# EAGLE design Aroca_EPS-v.2.0 (EAGLE 9.4.2)
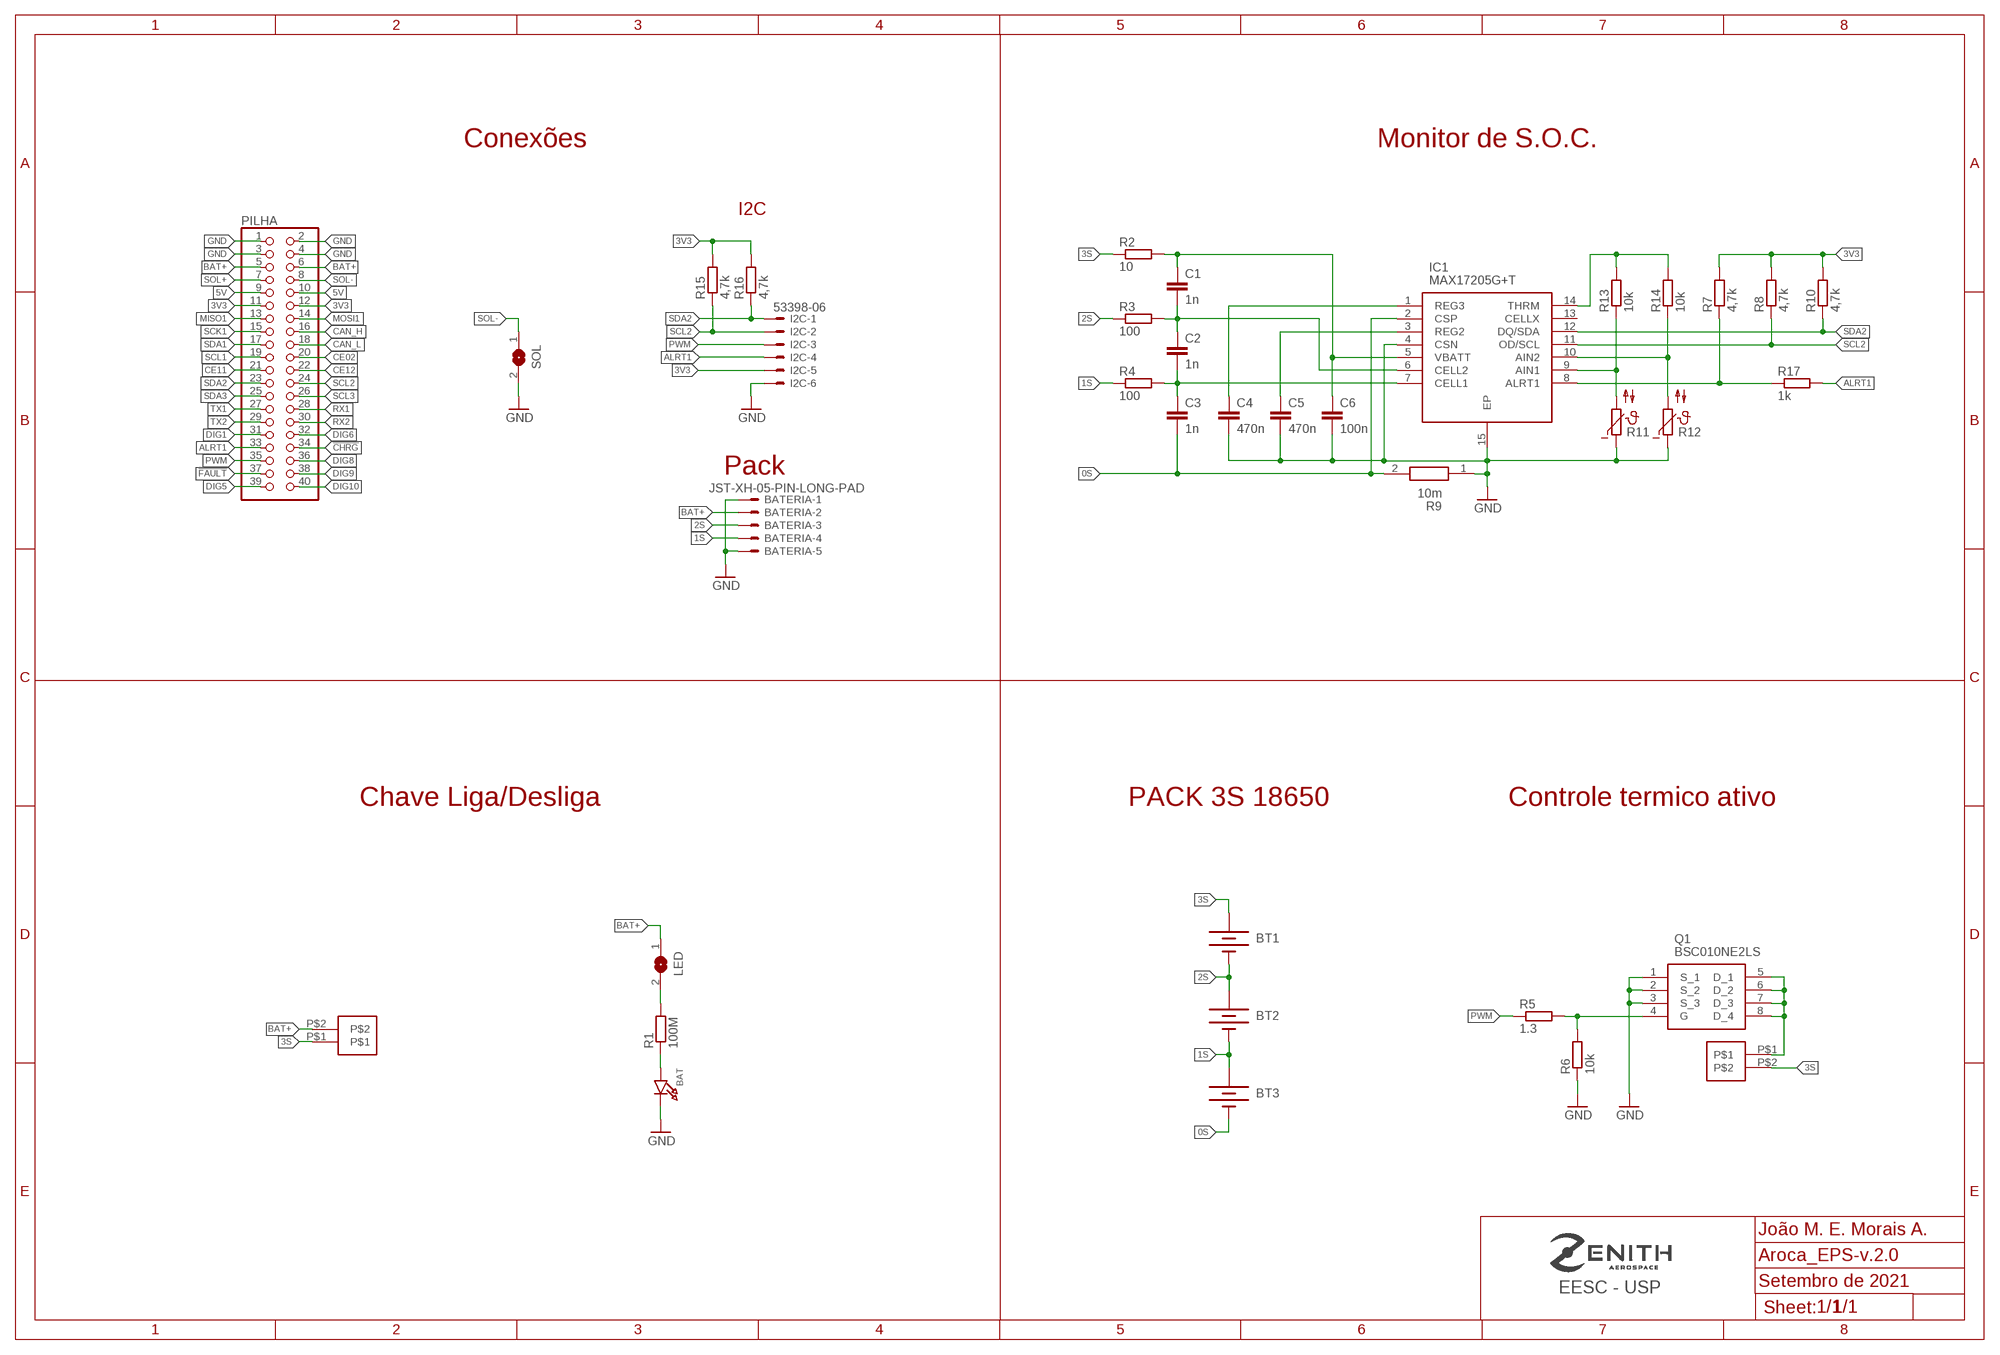
[diagram p0: schematic, sheet 1]

## Parts
BAT  LED1206  [CHIPLED_1206]
BATERIA  JST-XH-05-PIN-LONG-PAD  [JST-XH-05-PACKAGE-LONG-PAD]
BT1  BATTERY-18650  [BATTERY_18650-HOLDER]
BT2  BATTERY-18650  [BATTERY_18650-HOLDER]
BT3  BATTERY-18650  [BATTERY_18650-HOLDER]
C1  1n  C-EUC0805  [C0805]
C2  1n  C-EUC0805  [C0805]
C3  1n  C-EUC0805  [C0805]
C4  470n  C-EUC0805  [C0805]
C5  470n  C-EUC0805  [C0805]
C6  100n  C-EUC0805  [C0805]
I2C  53398-06  [53398-06]
IC1  MAX17205G+T  [SON40P300X300X80-15N]
LED  SOLDERJUMPERREFLOW_NOPASTE  [SOLDERJUMPER_REFLOW_NOPASTE]
PILHA  PINHD-2X20  [2X20]
Q1  BSC010NE2LS  [PG-TDSON-8]
R1  100M  R-EU_R0805  [R0805]
R2  10  R-EU_0204/7  [0204/7]
R3  100  R-EU_0204/7  [0204/7]
R4  100  R-EU_0204/7  [0204/7]
R5  1.3  R-EU_R0805  [R0805]
R6  10k  R-EU_R0805  [R0805]
R7  4,7k  R-EU_R0805  [R0805]
R8  4,7k  R-EU_R0805  [R0805]
R9  10m  GMR320HJBFA10L0  [GMR320HJBFA10L0]
R10  4,7k  R-EU_R0805  [R0805]
R11  NTC640  [P640]
R12  NTC640  [P640]
R13  10k  R-EU_R0805  [R0805]
R14  10k  R-EU_R0805  [R0805]
R15  4,7k  R-EU_R0805  [R0805]
R16  4,7k  R-EU_R0805  [R0805]
R17  1k  R-EU_R0805  [R0805]
SOL  SOLDERJUMPERREFLOW_NOPASTE  [SOLDERJUMPER_REFLOW_NOPASTE]
U$1  S02B-XASS-1  [S02B-XASS-1]
U$2  B02B-XASK-1  [B02B-XASK-1]

## Nets
0S: BT3.GND@1(-) C3.2 IC1.2(CSP) R9.2
1S: BATERIA.4 BT2.GND@1(-) BT3.PWR@1(+) R4.1
2S: BATERIA.3 BT1.GND@1(-) BT2.PWR@1(+) R3.1
3S: BT1.PWR@1(+) R2.1 U$1.P$1 U$2.P$2
3V3: I2C.5 PILHA.11 PILHA.12 R7.2 R8.2 R10.2 R15.2 R16.2
5V: PILHA.9 PILHA.10
!CHRG: PILHA.34
!FAULT: PILHA.37
ALRT: IC1.8(ALRT1) R7.1 R17.1
ALRT1: I2C.4 PILHA.33 R17.2
BAT+: BATERIA.2 LED.1 PILHA.5 PILHA.6 U$1.P$2
CAN_H: PILHA.16
CAN_L: PILHA.18
CE02: PILHA.20
CE11: PILHA.21
CE12: PILHA.22
DIG1: PILHA.31
DIG5: PILHA.39
DIG6: PILHA.32
DIG8: PILHA.36
DIG9: PILHA.38
DIG10: PILHA.40
GND: BAT.C BATERIA.1 BATERIA.5 C4.2 C5.2 C6.2 I2C.6 IC1.4(CSN) IC1.15(EP) PILHA.1 PILHA.2 PILHA.3 PILHA.4 Q1.1(S_1) Q1.2(S_2) Q1.3(S_3) R6.1 R9.1 R11.1 R12.1 SOL.2
MISO1: PILHA.13
MOSI1: PILHA.14
N$1: BAT.A R1.1
N$2: LED.2 R1.2
N$5: Q1.4(G) R5.2 R6.2
N$14: C4.1 IC1.1(REG3)
N$15: C5.1 IC1.3(REG2)
N$16: C1.1 C6.1 IC1.5(VBATT) R2.2
N$17: C2.2 C3.1 IC1.7(CELL1) R4.2
N$18: C1.2 C2.1 IC1.6(CELL2) R3.2
N$20: IC1.14(THRM) R13.2 R14.2
N$21: IC1.9(AIN1) R11.2 R13.1
N$22: IC1.10(AIN2) R12.2 R14.1
PWM: I2C.3 PILHA.35 R5.1
RL: Q1.5(D_1) Q1.6(D_2) Q1.7(D_3) Q1.8(D_4) U$2.P$1
RX1: PILHA.28
RX2: PILHA.30
SCK1: PILHA.15
SCL1: PILHA.19
SCL2: I2C.2 IC1.11(OD/SCL) PILHA.24 R8.1 R15.1
SCL3: PILHA.26
SDA1: PILHA.17
SDA2: I2C.1 IC1.12(DQ/SDA) PILHA.23 R10.1 R16.1
SDA3: PILHA.25
SOL+: PILHA.7
SOL-: PILHA.8 SOL.1
TX1: PILHA.27
TX2: PILHA.29
Unconnected: IC1.13(CELLX)

## Notes on the sheet
- Conexões | Monitor de S.O.C.
- I2C
- Pack
- Chave Liga/Desliga | PACK 3S 18650 | Controle termico ativo
- João M. E. Morais A.
- EESC - USP | Setembro de 2021
- 1/1
- C:/Users/marcu/Desktop/Ensino Superior/Graduação - Eng Elétrica/Zenith/zenith-v2.bmp

## Library data of the parts
BAT = microbuilder:LED: LED 0603 - 0603 Surface Mount Package 2mA: Green LED - Low Power (3.9mcd, 2ma, 1.7Vf) - Digikey: 475-2709-2-ND Orange LED - Low Power (9.8mcd, 2ma, 1.8Vf) - Digikey: 475-1194-2-ND Red LED - Low Power (5mcd, 2ma, 1.8Vf) - Digikey: 475-1195-2-ND Yellow LED - Low Power (7mcd, 2ma, 1.8Vf) - Digikey: 475-1196-2-ND 5mA: Blue LED - Low Power (17mcd, 5ma, 2.9Vf) - Digikey: LNJ937W8CRACT-ND 0805 - 0805 Surface Mount Package 2mA: Red LED (8.8mcd, 2mA, 1.8Vf, Clear) - Low Power [Digikey: 475-2510-1-ND] Green LED (5mcd, 2mA, 1.8Vf, Clear) - Low Power [Digikey: 475-2730-1-ND] Yellow LED (11.3mcd, 2mA, 1.8Vf, Clear) - Low Power [Digikey: 475-2555-1-ND] 20mA: Red LED (104mcd, 20mA, Diffused) - LS R976 [Digikey: 475-1278-6-ND] Red LED (12mcd, 20mA, 2.0Vf, Clear) - APT2012EC [Digikey: 754-1128-1-ND] Green LED (15mcd, 20mA, 2.2Vf, Clear) - APT2012GC [Digikey: 754-1131-1-ND] Orange LED (160mcd, 20mA, 2.1Vf, Clear) - APT2012SECK [Digikey: 754-1130-1-ND] 1206 - 1206 Surface Mount Package Green LED (26mcd, 20mA, Diffused) - LG N971 [Digikey: 475-1407-6-ND] Red LED (15mcd, 20mA, Diffused) - LH N974 [Digikey: 475-1416-6-ND]
BATERIA = JST-XH-Zenith:JST-XH-05-PIN: JST XH Connector 2 Pin Wire to board connector. Pitch: 2,54 mm, (0.100") Number of pins: 5 Created by Rembrandt Electronics www.rembrandtelectronics.com
BT1-BT3 = SparkFun-Batteries:BATTERY: Battery - Single Cell A variety of battery chemistries, sizes, and footprints. Device List: 20MM_PTH - Coin Cell Battery Holder - 20mm (PTH) <https://www.sparkfun.com/products/783> 6.8MM_PTH - Coin Cell Battery Holder - 6.8MM(SMD) <https://www.digikey.com/product-detail/en/seiko-instruments/MS621FE-FL11E/728-1057-ND/1889208?WT.srch=1&gclid=CNOQ5a6LzdQCFZS2wAodXCkE0g> 12MM_SMD - Coin Cell Battery Holder - 12mm (SMD) <https://www.sparkfun.com/products/10592> 12MM_PTH - Coin Cell Battery Holder - 12mm (PTH) <https://www.sparkfun.com/products/7948> 20MM_SMD - 20mm Coin Cell Battery Holder (SMD) (2 legs) Used on the Big Time Watch Kit <https://www.sparkfun.com/products/11734> 20MM_SMD_4LEGS - Coin Cell Battery Holder - 20mm (SMD) <https://www.sparkfun.com/products/11892> 20MM_SMD_4LEGS_OVERPASTE - Coin Cell Battery Holder - 20mm (SMD) <https://www.sparkfun.com/products/11892> (Over-paste on the legs) 24.5MM_PTH - Coin Cell Battery Holder - 24.5mm (PTH) <https://www.sparkfun.com/products/8863> 9V - 9V Battery Holder - PC Mount Used on the SparkFun SparkPunk Sound Kit <https://www.sparkfun.com/products/11177> and SparkFun SparkPunk Sequencer Kit <https://www.sparkfun.com/products/12707> 18650 - Battery Holder - 18650 (PTH) <https://www.sparkfun.com/products/13113> AA - Battery Holder - 1xAA (PTH) <https://www.sparkfun.com/products/7949> AAA - Battery Holder - 1xAAA (PTH) <https://www.sparkfun.com/products/12718> AA_KIT - Battery Holder - 1xAA (PTH) <https://www.sparkfun.com/products/7949> Special kit package - pads only have exposed copper on one side of the board. AAA_KIT - Battery Holder - 1xAAA (PTH) <https://www.sparkfun.com/products/12718> Special kit package - pads only have exposed copper on one side of the board.; PROD_ID: BATT-12327; SF_SKU: PRT-13113
C1-C6 = rcl:C-EU: CAPACITOR, European symbol; SPICEPREFIX: C
I2C = con-zenith:53?-06: CONNECTOR wire to board 1.25 mm (.049 inch) pitch header; MF: MOLEX; OC_FARNELL: 1125368; OC_NEWARK: unknown
IC1 = SamacSys_Parts:MAX17205G+T: Battery Management MODELGAUGE M5 (MULTI-CELL) TDFN Source: Datasheet <https://componentsearchengine.com/Datasheets/1/MAX17205G T.pdf>; DESCRIPTION: Battery Management MODELGAUGE M5 (MULTI-CELL) TDFN; HEIGHT: 0.8mm; MANUFACTURER_NAME: Maxim Integrated; MANUFACTURER_PART_NUMBER: MAX17205G+T; MOUSER_PART_NUMBER: 700-MAX17205G+T; MOUSER_PRICE-STOCK: https://www.mouser.co.uk/ProductDetail/Maxim-Integrated/MAX17205G%2bT?qs=sO%2FZ8XQFeM14gpZbIvukxg%3D%3D
LED SOL = microbuilder:SOLDERJUMPER: SMD Solder JUMPER Solder the two pads together to create a connection, or remove the solder to break it. REFLOW - Use this footprint for solder paste and reflow ovens. WAVE - Use this footprint for hand-soldering (larger pads). CLOSED - Has a trace between the two pads to ensure it is closed by default. The trace needs to be cut to disable the jumper, and can be closed again by creating a solder bridge between the two pads.
PILHA = pinhead:PINHD-2X20: PIN HEADER
Q1 = SamacSys_Parts:BSC010NE2LS: Infineon BSC010NE2LS N-channel MOSFET Transistor, 100 A, 25 V, 8-Pin TDSON Source: Datasheet <https://www.infineon.com/dgdl/Infineon-BSC010NE2LS-DS-v02_02-en.pdf?fileId=db3a304326dfb1300126fb3d176a3f1b>; DESCRIPTION: Infineon BSC010NE2LS N-channel MOSFET Transistor, 100 A, 25 V, 8-Pin TDSON; HEIGHT: mm; MANUFACTURER_NAME: Infineon; MANUFACTURER_PART_NUMBER: BSC010NE2LS; MOUSER_PART_NUMBER: 726-BSC010NE2LS; MOUSER_PRICE-STOCK: https://www.mouser.co.uk/ProductDetail/Infineon-Technologies/BSC010NE2LS?qs=HwMeRNENlMYcZAtWDSufww%3D%3D
R1-R8 R10 R13-R17 = rcl:R-EU_: RESISTOR, European symbol; SPICEPREFIX: R
R9 = SamacSys_Parts:GMR320HJBFA10L0: 10 +/-1% 10W Chip Resistor 2817 (7142 Metric) Current Sense Metal Element Source: Datasheet <https://fscdn.rohm.com/en/products/databook/datasheet/passive/resistor/chip_resistor/gmr-e.pdf>; DESCRIPTION: 10 +/-1% 10W Chip Resistor 2817 (7142 Metric) Current Sense Metal Element; HEIGHT: 0.55mm; MANUFACTURER_NAME: ROHM Semiconductor; MANUFACTURER_PART_NUMBER: GMR320HJBFA10L0; MOUSER_PART_NUMBER: 755-GMR320HJBFA10L0; MOUSER_PRICE-STOCK: https://www.mouser.co.uk/ProductDetail/ROHM-Semiconductor/GMR320HJBFA10L0?qs=iLbezkQI%252BsjglnCQsDzdJA%3D%3D
R11 R12 = ptc-ntc:NTC640: PHILIPS NTC; OC_FARNELL: unknown; OC_NEWARK: unknown
U$1 = JST-XA:S02B-XASS-1
U$2 = JST-XA:B02B-XASK-1

## Board
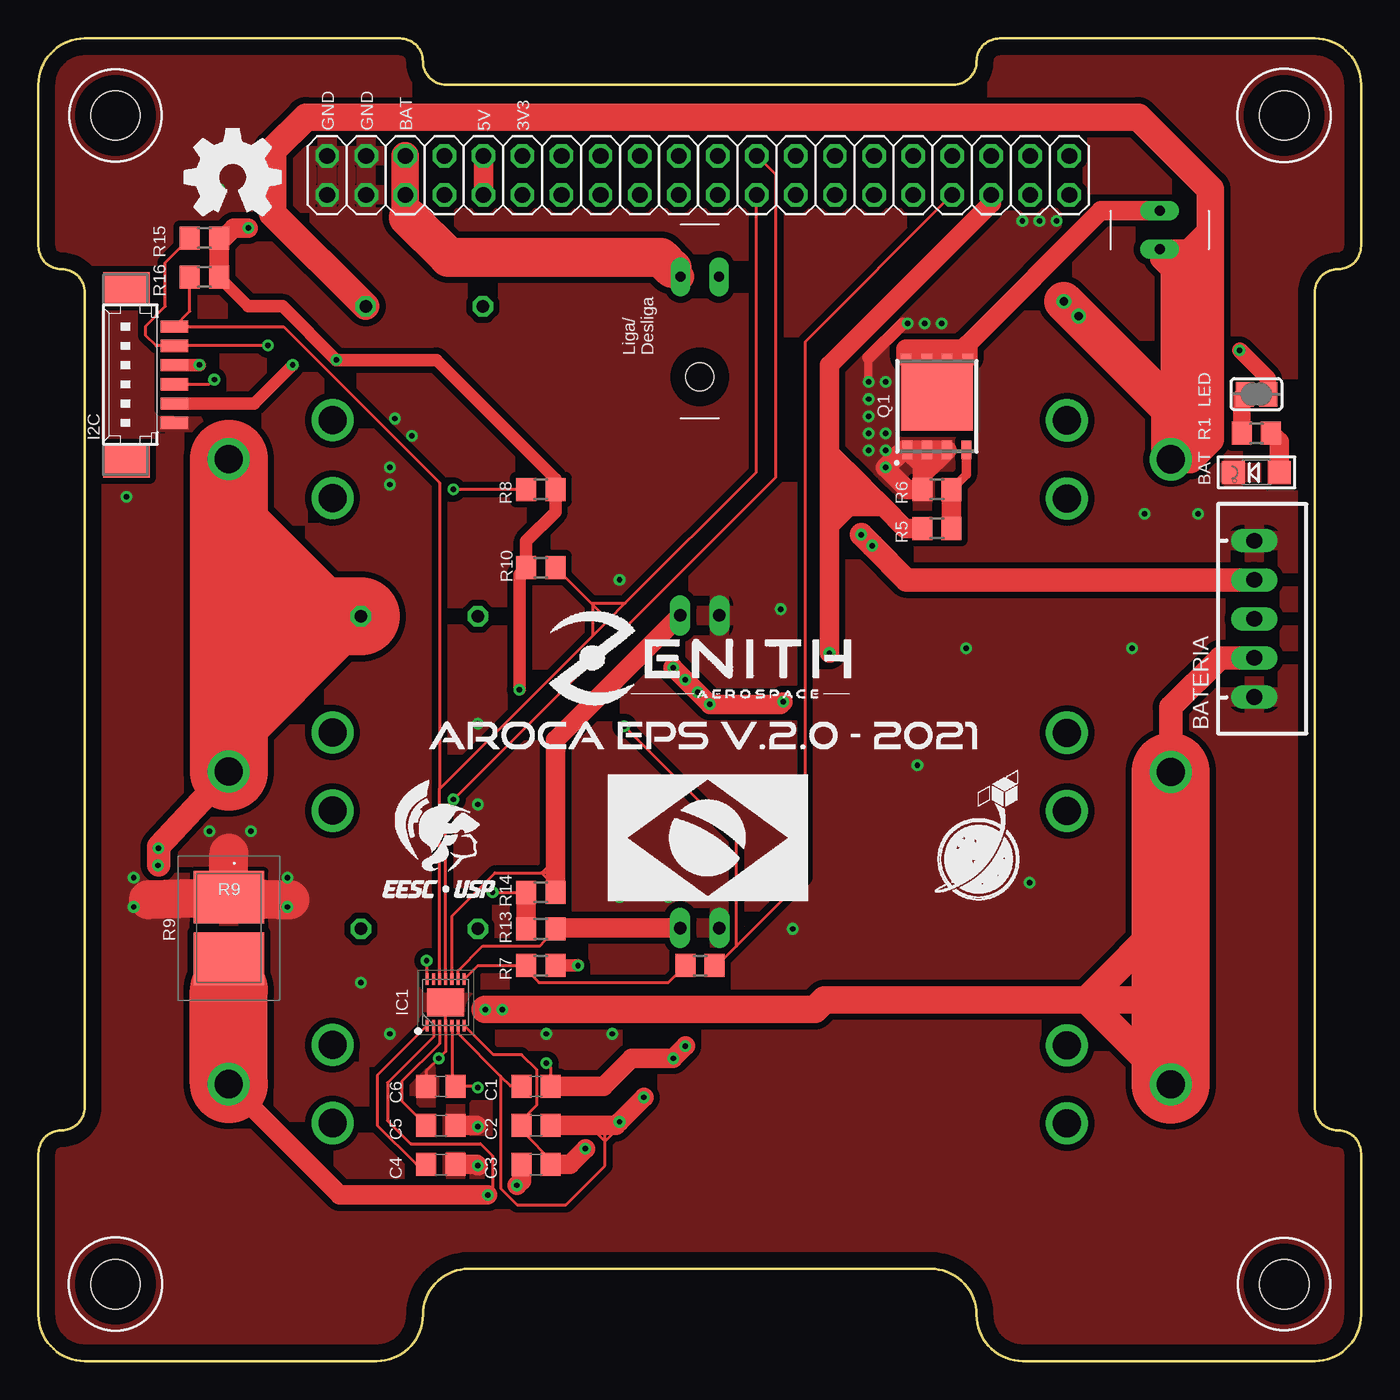
[diagram p1: board, top side]
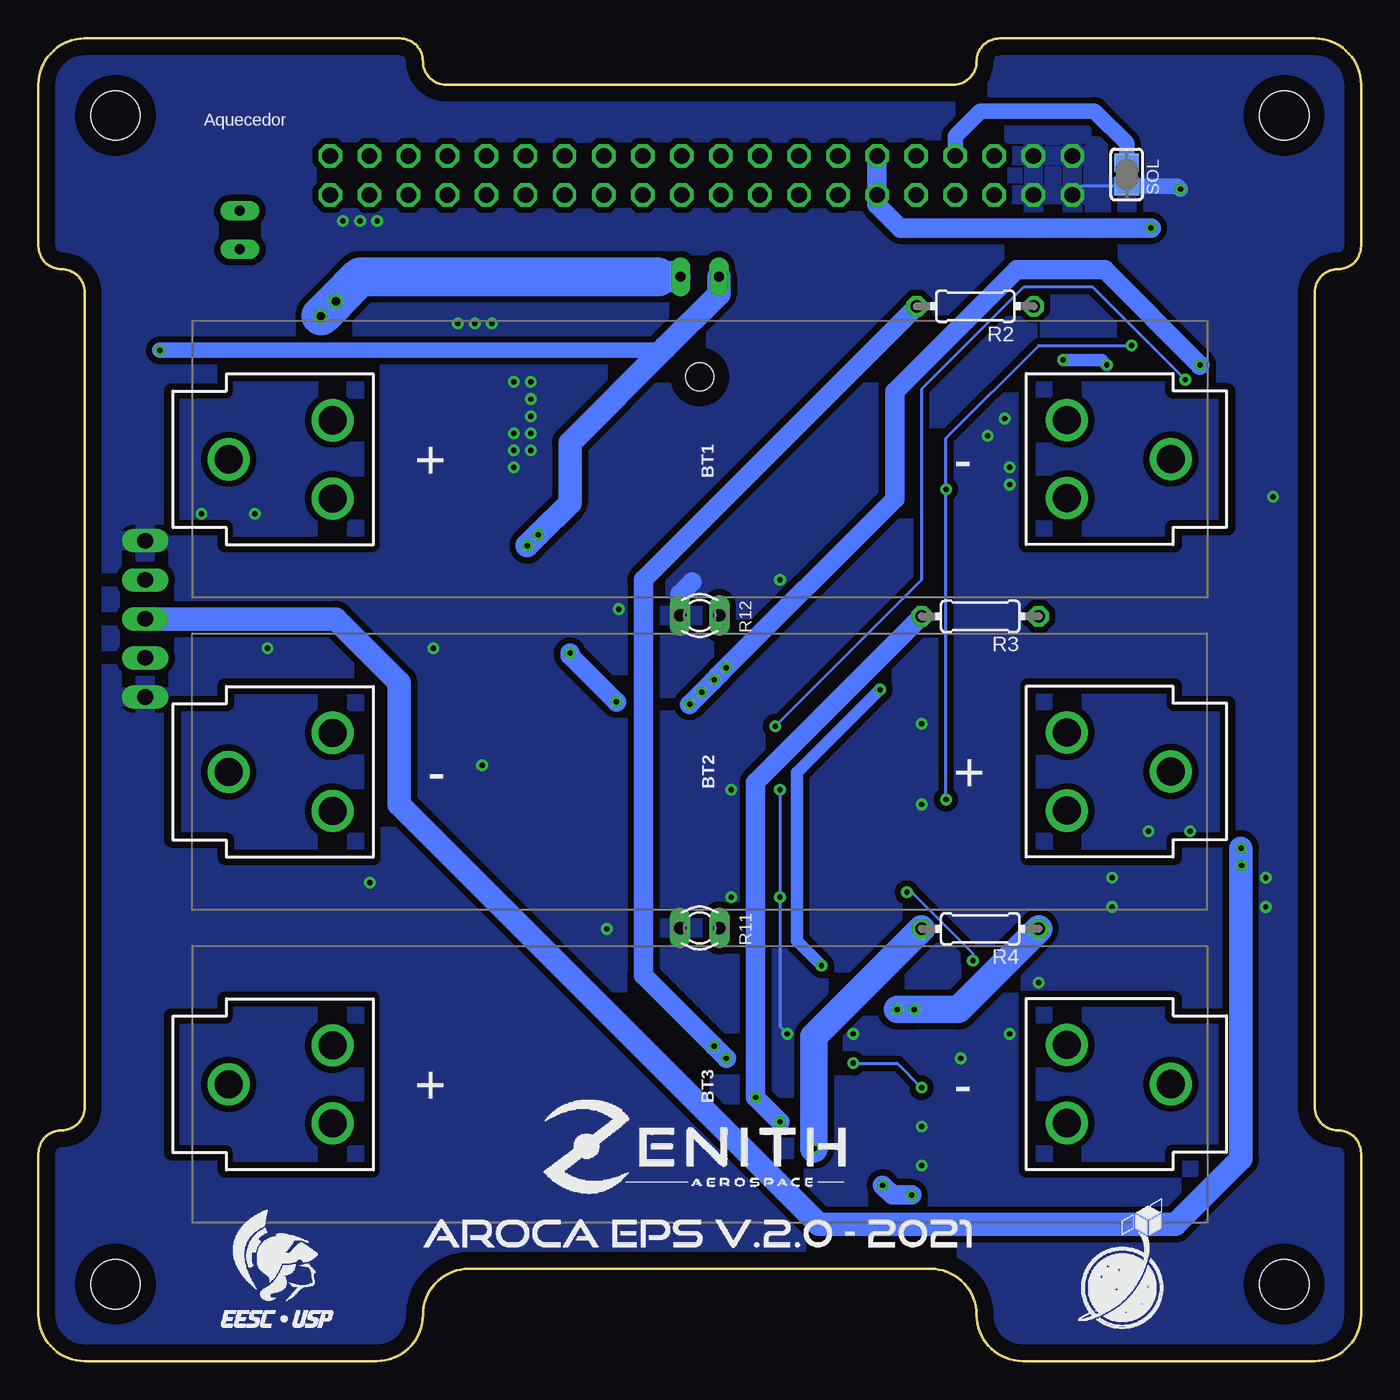
[diagram p2: board, bottom side, seen from below]

Size 86 x 86 mm. Coordinates in mm from the lower left corner, seen from the top.
Outline: 0,83 0,72.5 arc90 1.5,71 arc-90 3,69.5 3,16.5 arc-90 1.5,15 arc90 0,13.5 0,3 arc90 3,0 22,0 arc90 25,3 arc-90 28,6 58,6 arc-90 61,3 arc90 64,0 83,0 arc90 86,3 86,13.5 arc90 84.5,15 arc-90 83,16.5 83,69.5 arc-90 84.5,71 arc90 86,72.5 86,83 arc90 83,86 62.5,86 arc90 61,84.5 arc-90 59.5,83 26.5,83 arc-90 25,84.5 arc90 23.5,86 3,86 arc90 0,83
Copper layers (1*16): Top 0.035mm / dielectric 1.5mm / Bottom 0.035mm
Design rules "default *": minimum track width 6mil, minimum drill 0.35mm, track to track 6mil, track to pad 6mil, pad to pad 6mil, via to via 6mil, smd to smd 6mil, copper to edge 40mil, drill to drill 6mil, minimum pad ring 10mil, minimum via ring 8mil, stop-mask expansion 4mil, vias tented up to drill 30mil, thermal gap 10mil
Holes 3.2 mm at 5,5 81,5 81,81 5,81

### Footprints (pad centres in the part's own frame; a part is rotated, then mirrored left to right if it is on the bottom)
CHIPLED_1206 = smd 1.5 x 1.5: A 0,-1.496; C 0,1.496
JST-XH-05-PACKAGE-LONG-PAD = drill 1.016 long: 1 -5.08,0; 2 -2.54,0; 3 0,0; 4 2.54,0; 5 5.08,0
BATTERY_18650-HOLDER = drill 1.829: GND@1 30.628,0.01; GND@2 23.88,2.55; GND@3 23.88,-2.53; PWR@1 -30.628,-0.01; PWR@2 -23.88,2.53; PWR@3 -23.88,-2.55
C0805 = smd 1.3 x 1.5: 1 -0.95,0; 2 0.95,0
53398-06 = smd 0.8 x 1.8: 1 3.125,-2.5; 2 1.875,-2.5; 3 0.625,-2.5; 4 -0.625,-2.5; 5 -1.875,-2.5; 6 -3.125,-2.5 | smd 2.1 x 3: S1 5.625,0.625; S2 -5.625,0.625
SON40P300X300X80-15N = smd 0.75 x 0.2: 1 -1.5,1.2; 2 -1.5,0.8; 3 -1.5,0.4; 4 -1.5,0; 5 -1.5,-0.4; 6 -1.5,-0.8; 7 -1.5,-1.2; 8 1.5,-1.2; 9 1.5,-0.8; 10 1.5,-0.4; 11 1.5,0; 12 1.5,0.4; 13 1.5,0.8; 14 1.5,1.2 | smd 1.8 x 2.4: 15 0,0
SOLDERJUMPER_REFLOW_NOPASTE = smd 1.168 x 1.6: 1 -0.762,0; 2 0.762,0
2X20 = drill 1.016 octagon: 1 -24.13,-1.27; 2 -24.13,1.27; 3 -21.59,-1.27; 4 -21.59,1.27; 5 -19.05,-1.27; 6 -19.05,1.27; 7 -16.51,-1.27; 8 -16.51,1.27; 9 -13.97,-1.27; 10 -13.97,1.27; 11 -11.43,-1.27; 12 -11.43,1.27; 13 -8.89,-1.27; 14 -8.89,1.27; 15 -6.35,-1.27; 16 -6.35,1.27; 17 -3.81,-1.27; 18 -3.81,1.27; 19 -1.27,-1.27; 20 -1.27,1.27; 21 1.27,-1.27; 22 1.27,1.27; 23 3.81,-1.27; 24 3.81,1.27; 25 6.35,-1.27; 26 6.35,1.27; 27 8.89,-1.27; 28 8.89,1.27; 29 11.43,-1.27; 30 11.43,1.27; 31 13.97,-1.27; 32 13.97,1.27; 33 16.51,-1.27; 34 16.51,1.27; 35 19.05,-1.27; 36 19.05,1.27; 37 21.59,-1.27; 38 21.59,1.27; 39 24.13,-1.27; 40 24.13,1.27
PG-TDSON-8 = smd 0.65 x 1.2: 1 -1.905,-6; 2 -0.635,-6; 3 0.635,-6; 4 1.905,-6 | smd 0.7 x 0.5: 5 2,0; 6 0.665,0; 7 -0.665,0; 8 -2,0 | smd 4.7 x 4.5: 9 0,-2.5
R0805 = smd 1.3 x 1.5: 1 -0.95,0; 2 0.95,0
0204/7 = drill 0.813 octagon: 1 -3.81,0; 2 3.81,0
GMR320HJBFA10L0 = smd 3.4 x 4.6: 1 -2,0; 2 2,0
P640 = drill 0.813 long: 1 -1.27,0; 2 1.27,0
S02B-XASS-1 = drill 0.65 pad 1.27 long: P$1 0,0; P$2 2.5,0 | hole 1.8: 1.25,6.5
B02B-XASK-1 = drill 0.65 pad 1.27 long: P$1 0,0; P$2 2.5,0

### Placement (x,y rotation side)
BAT  79.19,57.78 90 top
BATERIA  79.06,48.26 270 top
BT1  43,58.64 0 bottom
BT2  43,38.32 180 bottom
BT3  43,18 0 bottom
C1  32.35,17.86 180 top
C2  32.35,15.32 180 top
C3  32.35,12.78 180 top
C4  26.16,12.78 0 top
C5  26.16,15.32 0 top
C6  26.16,17.86 180 top
I2C  6.35,64.14 90 top
IC1  26.48,23.32 90 top
LED  79.19,62.87 180 top
PILHA  42.9,77.1 0 top
Q1  58.42,65.25 0 top
R1  79.19,60.33 180 top
R2  25.09,68.58 180 bottom
R3  24.77,48.42 180 bottom
R4  24.77,28.1 180 bottom
R5  58.42,54.13 0 top
R6  58.42,56.67 0 top
R7  32.67,25.72 0 top
R8  32.67,56.67 0 top
R9  12.38,28.16 270 top
R10  32.67,51.59 180 top
R11  43,28.16 0 bottom
R12  43,48.48 0 bottom
R13  32.67,28.1 180 top
R14  32.67,30.48 180 top
R15  10.79,73.03 0 top
R16  10.79,70.48 0 top
R17  43.02,25.72 0 top
SOL  15.24,77.15 270 bottom
U$1  44.25,70.5 180 top
U$2  72.9,74.8 270 top

### Tracks (layer width: path | path; a pad name or v marks a point on that pad's centre or on a via)
0S  (via drill 0.35)
  Top 0.2: IC1.2 25.68,21.08 22.7,18.1 22.7,15.63 24.2,14.13 28.73,14.13 29.53,13.34 29.53,11.11 v29.21,10.79
  Top 1.27: C3.2 31.4,11.72 v31.11,11.43 | BT3.GND@1 19.59,10.79 v29.21,10.79
  Top 3.302: 12.38,24.13 R9.2
  Top 5.08: BT3.GND@1 12.37,24.12 12.38,24.13
  Bottom 1.27: v31.11,11.43 30.48,10.79 v29.21,10.79
1S  (via drill 0.35)
  Top 1.27: 73.63,29 73.63,29.21
  Top 1.524: BATERIA.4 76.83,45.72 73.63,42.51 BT2.GND@1
  Top 1.778: v29.05,22.86 v30.16,22.86 50.48,22.86 51.12,23.5 68.12,23.5 | 68.12,23.5 BT3.PWR@1 | 68.12,23.5 73.63,29 | 68.12,23.5 73.63,23.5
  Top 5.08: BT3.PWR@1 73.63,23.5 73.63,29.21 BT2.GND@1
  Bottom 1.778: R4.1 26.2,22.86 v29.05,22.86 v30.16,22.86
2S  (via drill 0.35)
  Top 1.27: v7.78,32.23 7.81,32.26
  Top 1.524: BT2.PWR@1 7.81,33.45 v7.81,33.34 7.81,32.26
  Top 5.08: BT1.GND@1 12.37,54.29 | 12.37,54.29 12.37,46.99 | 12.37,46.99 12.37,41.59 | 12.37,41.59 BT2.PWR@1 | 12.37,54.29 18.72,47.94 12.37,41.59 | R3.1 13.8,48.42 12.37,46.99
  Bottom 1.524: BATERIA.3 66.67,48.26 62.55,44.13 62.55,36.2 35.24,8.89 12.06,8.89 7.81,13.14 v7.81,33.34
3S  (via drill 0.55)
  Top 1.27: 74.71,72.3 U$2.P$2 72.9,71.66 74.26,70.3 | 74.71,72.3 75.56,71.44 | 74.71,72.3 76.2,73.79 76.2,74.37
  Top 1.778: BT1.PWR@1 74.9,58.63 76.2,59.93 76.2,74.37 76.2,76.2 71.51,80.89 17.39,80.89 15.24,78.74 15.24,74.62 R2.1
  Top 2.54: v66.67,68.9 v67.63,67.94 73.63,61.94 BT1.PWR@1 74.26,59.27 74.26,70.3 74.26,71.09 74.3,71.12
  Bottom 1.27: U$1.P$1 44.6,70.5 44.61,70.48
  Bottom 2.032: 45.72,70.5 44.6,70.5
  Bottom 2.54: 45.72,70.5 65.08,70.5 v66.67,68.9 v67.63,67.94
3V3  (via drill 0.35)
  Top 0.813: I2C.5 14.02,62.26 v16.52,64.77 | R16.2 13.65,68.58 15.88,68.58 v19.37,65.09 25.87,65.09 33.62,57.34 R8.2 33.62,55.21 31.72,53.31 R10.2 31.27,51.15 v31.27,43.66 | R7.2 v35.08,25.72
  Top 1.27: R15.2 11.74,72.72 | 11.74,72.72 R16.2 | v13.65,73.67 12.7,73.67 11.74,72.72
  Bottom 0.813: v19.37,65.09 16.84,65.09 v16.52,64.77 | v35.08,25.72 36.67,27.3 36.67,38.26 v31.27,43.66
  Bottom 1.27: PILHA.12 PILHA.11 31.47,75.2 29.94,73.67 v13.65,73.67
5V
  Top 1.27: PILHA.10 PILHA.9
ALRT
  Top 0.2: IC1.8 28.58,25.72 R7.1 31.72,25.43 32.54,24.61 40.96,24.61 R17.1
ALRT1  (via drill 0.35)
  Top 0.2: 45.4,26.99 49.85,31.43 49.85,66.27 PILHA.33 | v38.1,41.27 45.4,33.97 45.4,26.99 | I2C.4 11.09,63.51 11.4,63.82 v11.43,63.82 | 45.4,26.99 44.13,25.72 R17.2
  Bottom 0.2: v38.1,41.27 28.57,50.8 28.57,63.19 21.91,69.86 17.46,69.86 v11.43,63.82
BAT+  (via drill 0.35)
  Top 1.016: LED.1 79.96,63.87 v78.11,65.72
  Top 1.524: v53.5,53.74 v54.21,53.02 56.44,50.8 BATERIA.2
  Top 1.778: PILHA.6 PILHA.5 23.85,74.58 24.05,74.37 | 41.2,71.05 U$1.P$2
  Top 2.54: 41.2,71.05 40.48,71.77 26.66,71.77 24.05,74.37
  Bottom 1.016: v78.11,65.72 45.4,65.72 45.24,65.88
  Bottom 1.524: U$1.P$2 41.75,69.38 45.24,65.88 51.44,59.69 51.44,55.8 v53.5,53.74 v54.21,53.02
GND  (via drill 0.35)
  Top 0.2: IC1.15 IC1.4 26.48,20.13 v26.04,19.68 25.21,18.86 C6.2 | 28.5,15.32 v28.57,15.24
  Top 0.508: v53.98,63.66 53.98,65.25 | 56.2,67.47 v56.52,67.47
  Top 0.813: 56.2,67.47 53.98,65.25
  Top 1.27: C5.2 28.5,15.32 | C4.2 28.5,12.78 v28.57,12.7 | 57.47,57.66 R6.1 56.52,56.67 v55.09,58.1 56.23,59.25 Q1.1 | 57.47,57.66 Q1.3 Q1.1 | Q1.1 57.47,58.29 57.47,57.66
  Top 2.54: R9.1 16.35,30 | R9.1 12.38,33.02 | R9.1 7.15,30
  Bottom 0.2: SOL.2 18.21,76.39 PILHA.1 | v37.78,37.15 v37.78,30.16 37.78,21.75 v37.31,21.27
  Bottom 1.016: SOL.2 11.94,76.39 v11.75,76.2
  Bottom 1.27: R12.1 44.27,49.87 43.5,50.64
  other vias: 37.78,50.8 57.15,38.73 60.33,46.35 5.71,56.2 64.45,31.11 49.05,28.1 55.09,59.21 48.26,48.9 71.12,46.35 71.91,55.09 75.41,55.09 33.02,21.27 22.86,21.27 20.95,24.61 28.57,41.44 28.57,36.2 40.96,37.15 16.19,29.53 16.19,31.43 11.11,34.45 13.81,34.45 6.19,31.43 6.19,29.53 22.86,58.1 22.86,56.99 23.18,61.28 24.29,60.17 40.96,30.16 55.09,60.33 53.98,59.21 53.98,60.33 53.98,61.44 53.98,62.55 55.09,63.66 57.63,67.47 58.74,67.47 66.2,74.14 65.09,74.14 63.98,74.14
  pour Top (isolate 0.406): 64,0 83,0 arc90 86,3 86,13.5 arc90 84.5,15 arc-90 83,16.5 83,69.5 arc-90 84.5,71 arc90 86,72.5 86,83 arc90 83,86 62.5,86 arc90 61,84.5 arc-90 59.5,83 26.5,83 arc-90 25,84.5 arc90 23.5,86 3,86 arc90 0,83 0,72.5 arc90 1.5,71 arc-90 3,69.5 3,16.5 arc-90 1.5,15 arc90 0,13.5 0,3 arc90 3,0 22,0 arc90 25,3 arc-90 28,6 58,6 arc-90 61,3 arc90
  pour Bottom (isolate 0.406): 64,0 83,0 arc90 86,3 86,13.5 arc90 84.5,15 arc-90 83,16.5 83,69.5 arc-90 84.5,71 arc90 86,72.5 86,83 arc90 83,86 62.5,86 arc90 61,84.5 arc-90 59.5,83 26.5,83 arc-90 25,84.5 arc90 23.5,86 3,86 arc90 0,83 0,72.5 arc90 3.09,69.41 3.09,16.27 arc90 0,13.18 0,3 arc90 3,0 22,0 arc90 25,3 arc-90 28,6 58,6 arc-90 61,3 arc90
N$1
  Top 1.27: R1.1 80.69,59.78 BAT.A
N$2
  Top 1.143: LED.2 78.25,62.68 R1.2
N$5
  Top 0.61: Q1.4 60.33,57.63 R6.2
  Top 1.27: R5.2 R6.2
N$14
  Top 0.2: IC1.1 22.04,18.57 22.04,15.32 24.58,12.78 C4.1
N$15
  Top 0.2: IC1.3 26.08,20.64 23.62,18.18 23.62,16.91 C5.1
N$16  (via drill 0.35)
  Top 0.2: v33.02,19.37 33.3,19.08 C1.1 | v28.57,17.78 28.5,17.86 C6.1 26.88,18.09 IC1.5
  Top 1.27: v42.07,20.48 v41.27,19.68 38.58,19.68 36.75,17.86 C1.1
  Bottom 0.2: v33.02,19.37 30.16,19.37 v28.57,17.78
  Bottom 1.27: R2.2 46.67,50.81 46.67,25.08 v42.07,20.48 v41.27,19.68
N$17  (via drill 0.35)
  Top 0.2: 33.28,12.8 C3.1 | IC1.7 29.59,19.91 31.42,19.91 32.39,18.95 32.39,16.62 31.4,15.64 C2.2 31.4,15 33.6,12.8
  Top 1.27: v35.56,13.81 34.55,12.8 33.6,12.8 33.28,12.8
  Bottom 1.778: v35.56,13.81 35.56,21.11 R4.2
N$18  (via drill 0.35)
  Top 0.2: C1.2 31.43,17.88 30.69,17.88 30.06,18.52 | 36.83,14.29 36.83,12.7 34.29,10.16 31.11,10.16 30.06,11.22 30.06,18.52 | 36.83,14.29 36.83,15.32 | 35.8,15.32 36.83,14.29 | IC1.6 27.28,21.3 30.06,18.52 | 36.83,14.29 37.78,15.24 v37.78,15.56
  Top 1.27: C2.1 35.8,15.32 36.83,15.32 37.55,15.32 v37.78,15.56 v39.37,17.14
  Bottom 1.27: R3.2 39.37,37.63 v39.37,17.14 v37.78,15.56
N$20  (via drill 0.35)
  Top 0.2: IC1.14 25.28,26.07 v25.24,26.04 | v29.53,30.48 R14.2
  Top 1.27: R14.2 R13.2
  Bottom 0.2: v29.53,30.48 29.21,30.48 25.24,26.51 v25.24,26.04
N$21
  Top 0.2: IC1.9 27.28,25.38 28.89,26.99 32.6,26.99 R13.1
  Top 1.27: 33.84,28.16 R13.1 33.68,28.16 R11.2
N$22
  Top 0.2: IC1.10 26.88,28.94 29.69,31.75 32.7,31.75 | 33.78,31.75 32.7,31.75 | 32.7,31.75 33.34,31.11 33.66,31.11 | 33.66,31.11 33.78,31.11 | 32.7,31.75 33.78,32.83 33.78,33.02 | R14.1 33.62,31.08 33.66,31.11
  Top 1.27: R14.1 33.62,40.37 R12.2
PWM  (via drill 0.35)
  Top 0.813: I2C.3 10.47,64.76 v10.48,64.77
  Top 1.27: PILHA.35 61.95,75.28 51.44,64.77 51.44,59.05 | v51.44,46.04 51.44,54.29 | 51.44,54.29 51.44,55.72 | 51.44,55.72 51.44,57.15 | 51.44,57.15 51.44,59.05 | R5.1 56.36,54.13 54.93,55.56 | 54.93,55.56 53.82,56.67 | 53.82,56.67 53.58,56.91 | 53.58,56.91 51.44,59.05 | v48.42,42.86 48.26,42.7 v43.66,42.7 v41.27,45.09 | 51.44,54.29 52.7,55.56 | 52.7,55.56 53.82,56.67 | 52.7,55.56 54.93,55.56 | 53.58,56.91 51.67,56.91 51.44,57.15 | 51.44,55.72 51.91,56.2 52.55,56.2
  Bottom 0.2: v42.86,43.5 42.15,44.21 v42.07,44.29
  Bottom 0.813: 41.83,44.53 v41.27,45.09 41.67,44.69
  Bottom 1.27: v51.44,46.04 51.44,45.88 v48.42,42.86 | v43.66,42.7 42.15,44.21 41.67,44.69 | 41.83,44.53 30.32,56.04 30.32,63.02 22.38,70.96 16.67,70.96 v10.48,64.77
RL
  Top 1.27: U$2.P$1 69.08,74.8 60.42,66.14 | 60.42,66.14 60.07,65.78 56.42,65.78 Q1.8 Q1.7 Q1.6 Q1.5 60.42,66.14
SCL2  (via drill 0.35)
  Top 0.2: IC1.11 26.48,36.01 v26.98,36.52 47.94,57.47 47.94,77.15 46.73,78.37 PILHA.24 | v14.92,66.04 14.89,66.01 I2C.2 7.65,66.01 6.99,66.67 6.99,67.31 8.26,68.58 8.26,71.44 R15.1 | R8.1 v26.99,56.67
  Bottom 0.2: v26.98,36.52 v26.98,56.68 | v26.98,56.68 26.98,60.01 20.95,66.04 v14.92,66.04 | v26.99,56.67 v26.98,56.68
SDA2
  Top 0.2: IC1.12 26.08,37.2 | 26.08,37.2 36.02,47.14 | 36.02,47.14 37.06,48.18 | 37.06,48.18 38.16,49.27 | 38.16,49.27 46.67,57.79 46.67,75.79 PILHA.23 | 26.08,37.2 26.08,57.11 15.93,67.26 I2C.1 9.85,68.25 R16.1 | R10.1 35.94,49.27 | 35.94,49.27 36.02,49.2 | 36.02,49.2 37.03,48.18 37.06,48.18 | 35.94,49.27 38.16,49.27 | 36.02,49.2 36.02,47.14
SOL-
  Bottom 1.016: PILHA.8 26.39,79.64 24.75,81.28 17.34,81.28 15.24,79.18 SOL.1

### Text on the board
tNames: GND | GND | BAT | 5V | 3V3 | Liga/ / Desliga | R9
bNames: Aquecedor